# Altium schematic sheet MasterSheet.SchDoc
size A
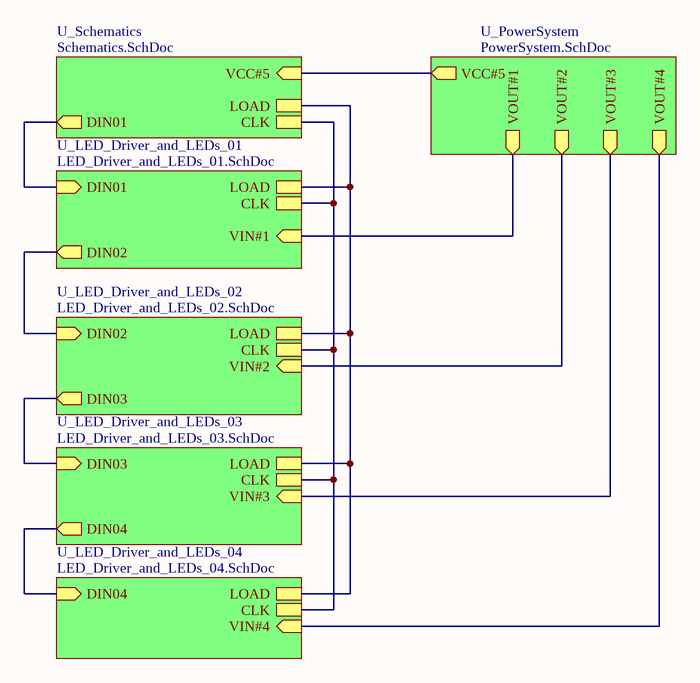
[diagram p0: MasterSheet.SchDoc]

## Sub-sheets
U_LED_Driver_and_LEDs_01 = LED_Driver_and_LEDs_01.SchDoc: VIN#1 (in), DIN02 (out), DIN01 (in), LOAD, CLK
U_LED_Driver_and_LEDs_02 = LED_Driver_and_LEDs_02.SchDoc: VIN#2 (in), DIN02 (in), DIN03 (out), LOAD, CLK
U_LED_Driver_and_LEDs_03 = LED_Driver_and_LEDs_03.SchDoc: VIN#3 (in), DIN03 (in), DIN04 (out), LOAD, CLK
U_LED_Driver_and_LEDs_04 = LED_Driver_and_LEDs_04.SchDoc: VIN#4 (in), DIN04 (in), LOAD, CLK
U_PowerSystem = PowerSystem.SchDoc: VOUT#2 (out), VOUT#3 (out), VOUT#4 (out), VOUT#1 (out), VCC#5 (out)
U_Schematics = Schematics.SchDoc: DIN01 (out), VCC#5 (in), CLK, LOAD

## Nets
(unnamed): sheet U_PowerSystem/VOUT#2, sheet U_LED_Driver_and_LEDs_02/VIN#2
(unnamed): sheet U_PowerSystem/VOUT#3, sheet U_LED_Driver_and_LEDs_03/VIN#3
(unnamed): sheet U_PowerSystem/VOUT#4, sheet U_LED_Driver_and_LEDs_04/VIN#4
(unnamed): sheet U_PowerSystem/VOUT#1, sheet U_LED_Driver_and_LEDs_01/VIN#1
(unnamed): sheet U_PowerSystem/VCC#5, sheet U_Schematics/VCC#5
(unnamed): sheet U_LED_Driver_and_LEDs_01/DIN02, sheet U_LED_Driver_and_LEDs_02/DIN02
(unnamed): sheet U_LED_Driver_and_LEDs_01/DIN01, sheet U_Schematics/DIN01
(unnamed): sheet U_LED_Driver_and_LEDs_01/LOAD, sheet U_LED_Driver_and_LEDs_02/LOAD, sheet U_LED_Driver_and_LEDs_03/LOAD, sheet U_LED_Driver_and_LEDs_04/LOAD, sheet U_Schematics/LOAD
(unnamed): sheet U_LED_Driver_and_LEDs_01/CLK, sheet U_LED_Driver_and_LEDs_02/CLK, sheet U_LED_Driver_and_LEDs_03/CLK, sheet U_LED_Driver_and_LEDs_04/CLK, sheet U_Schematics/CLK
(unnamed): sheet U_LED_Driver_and_LEDs_02/DIN03, sheet U_LED_Driver_and_LEDs_03/DIN03
(unnamed): sheet U_LED_Driver_and_LEDs_03/DIN04, sheet U_LED_Driver_and_LEDs_04/DIN04